# EAGLE design V2.0 (EAGLE 6.5.0)
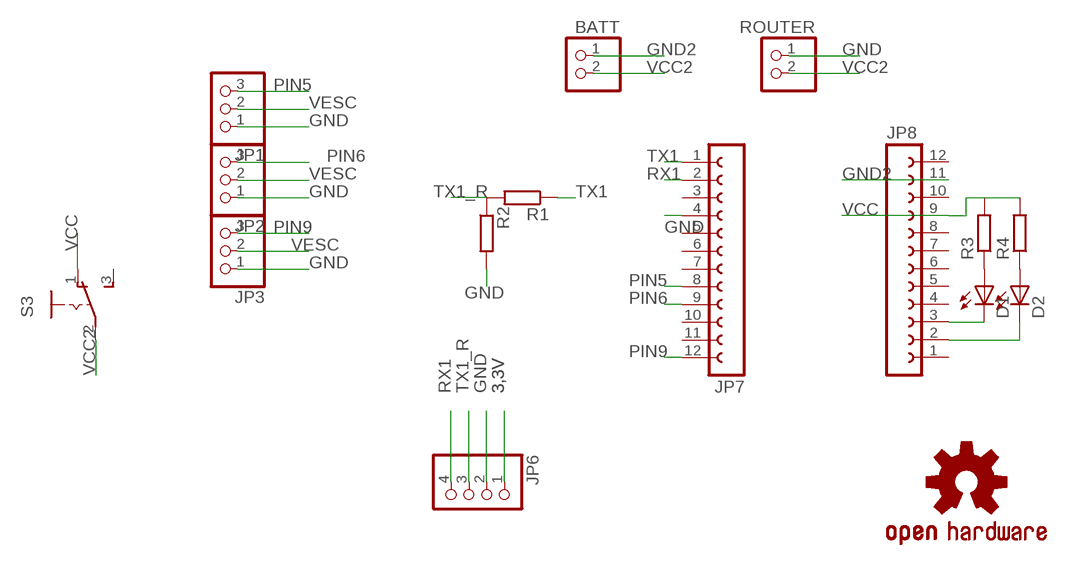
[diagram p0: schematic, sheet 1]

## Parts
BATT  PINHD-1X2/90  [1X02/90]
D1  LED3MM  [LED3MM]
D2  LED3MM  [LED3MM]
JP1  PINHD-1X3  [1X03]
JP2  PINHD-1X3  [1X03]
JP3  PINHD-1X3  [1X03]
JP6  PINHD-1X4  [1X04]
JP7  FE12-1  [FE12]
JP8  FE12-1  [FE12]
R1  R-EU_0204/7  [0204/7]
R2  R-EU_0204/7  [0204/7]
R3  R-EU_0204/7  [0204/7]
R4  R-EU_0204/7  [0204/7]
ROUTER  PINHD-1X2/90  [1X02/90]
S3  M251  [M251]
U$2  OSHW-LOGOS  [OSHW-LOGO-S]

## Nets
3,3V: JP6.1
GND: JP1.1 JP2.1 JP3.1 JP6.2 JP7.4 R2.2 ROUTER.1
GND2: BATT.1 JP8.11
N$2: D2.K(C) JP8.2
N$3: D1.K(C) JP8.3
N$6: D1.A R3.1
N$7: D2.A R4.1
PIN5: JP1.3 JP7.8
PIN6: JP2.3 JP7.9
PIN9: JP3.3 JP7.12
RX1: JP6.4 JP7.2
TX1: JP7.1 R1.1
TX1_R: JP6.3 R1.2 R2.1
VCC: JP8.9 R3.2 R4.2 S3.1(O)
VCC2: BATT.2 ROUTER.2 S3.2(P)
VESC: JP1.2 JP2.2 JP3.2
Unconnected: JP7.3 JP7.5 JP7.6 JP7.7 JP7.10 JP7.11 JP8.1 JP8.4 JP8.5 JP8.6 JP8.7 JP8.8 JP8.10 JP8.12 S3.3(S)

## Library data of the parts
BATT ROUTER = pinhead:PINHD-1X2: PIN HEADER
D1 D2 = led:LED: LED OSRAM: - CHIPLED LG R971, LG N971, LY N971, LG Q971, LY Q971, LO R971, LY R971 LH N974, LH R974 LS Q976, LO Q976, LY Q976 LO Q996 - Hyper CHIPLED LW Q18S LB Q993, LB Q99A, LB R99A - SideLED LS A670, LO A670, LY A670, LG A670, LP A670 LB A673, LV A673, LT A673, LW A673 LH A674 LY A675 LS A676, LA A676, LO A676, LY A676, LW A676 LS A679, LY A679, LG A679 - Hyper Micro SIDELED® LS Y876, LA Y876, LO Y876, LY Y876 LT Y87S - SmartLED LW L88C, LW L88S LB L89C, LB L89S, LG L890 LS L89K, LO L89K, LY L89K LS L896, LA L896, LO L896, LY L896 - TOPLED LS T670, LO T670, LY T670, LG T670, LP T670 LSG T670, LSP T670, LSY T670, LOP T670, LYG T670 LG T671, LOG T671, LSG T671 LB T673, LV T673, LT T673, LW T673 LH T674 LS T676, LA T676, LO T676, LY T676, LB T676, LH T676, LSB T676, LW T676 LB T67C, LV T67C, LT T67C, LS T67K, LO T67K, LY T67K, LW E67C LS E67B, LA E67B, LO E67B, LY E67B, LB E67C, LV E67C, LT E67C LW T67C LS T679, LY T679, LG T679 LS T770, LO T770, LY T770, LG T770, LP T770 LB T773, LV T773, LT T773, LW T773 LH T774 LS E675, LA E675, LY E675, LS T675 LS T776, LA T776, LO T776, LY T776, LB T776 LHGB T686 LT T68C, LB T68C - Hyper Mini TOPLED® LB M676 - Mini TOPLED Santana® LG M470 LS M47K, LO M47K, LY M47K Source: http://www.osram.convergy.de LUXEON: - LUMILED® LXK2-PW12-R00, LXK2-PW12-S00, LXK2-PW14-U00, LXK2-PW14-V00 LXK2-PM12-R00, LXK2-PM12-S00, LXK2-PM14-U00 LXK2-PE12-Q00, LXK2-PE12-R00, LXK2-PE12-S00, LXK2-PE14-T00, LXK2-PE14-U00 LXK2-PB12-K00, LXK2-PB12-L00, LXK2-PB12-M00, LXK2-PB14-N00, LXK2-PB14-P00, LXK2-PB14-Q00 LXK2-PR12-L00, LXK2-PR12-M00, LXK2-PR14-Q00, LXK2-PR14-R00 LXK2-PD12-Q00, LXK2-PD12-R00, LXK2-PD12-S00 LXK2-PH12-R00, LXK2-PH12-S00 LXK2-PL12-P00, LXK2-PL12-Q00, LXK2-PL12-R00 Source: www.luxeon.com KINGBRIGHT: KA-3528ASYC Source: www.kingbright.com
JP1-JP3 = pinhead:PINHD-1X3: PIN HEADER
JP6 = pinhead:PINHD-1X4: PIN HEADER
JP7 JP8 = con-lsta:FE12-1: FEMALE HEADER; OC_FARNELL: unknown; OC_NEWARK: unknown
R1-R4 = rcl:R-EU_: RESISTOR, European symbol
S3 = switch:M251: SLIDING SWITCH Mors, distributor Buerklin, 11G702
U$2 = SparkFun:OSHW-LOGO: Open Source Hardware Logo This logo indicates the piece of hardware it is found on incorporates a OSHW license and/or adheres to the definition of open source hardware found here: http://freedomdefined.org/OSHW

## Board
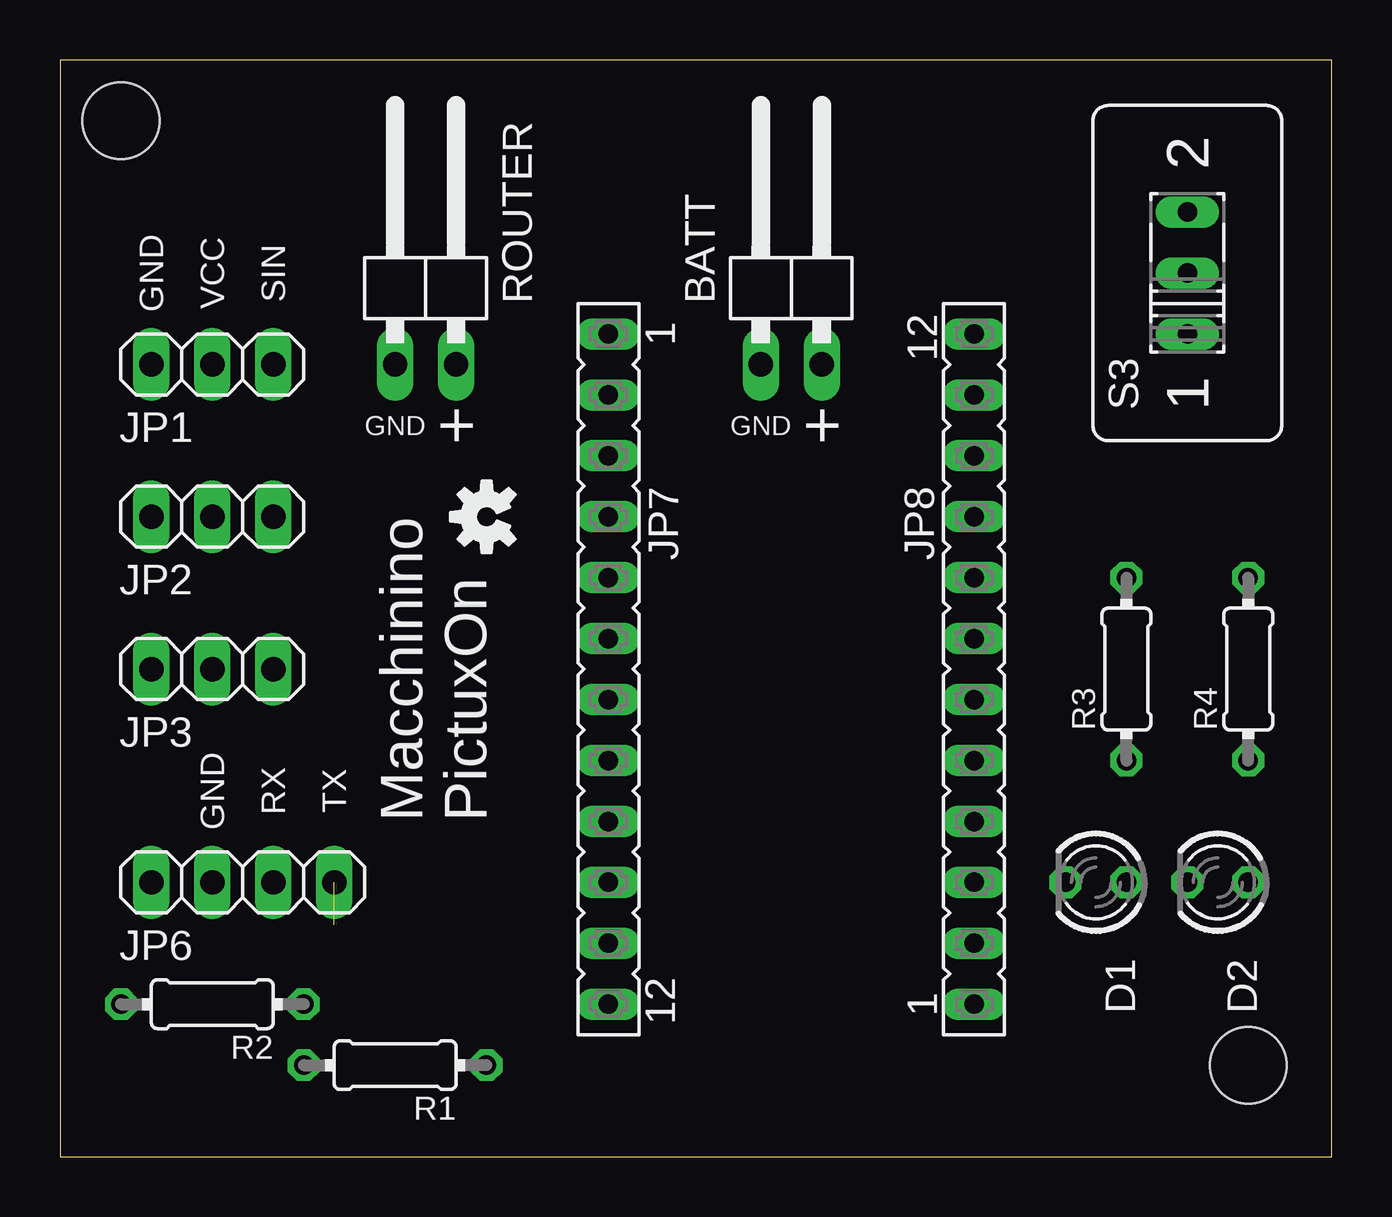
[diagram p1: board, top side]
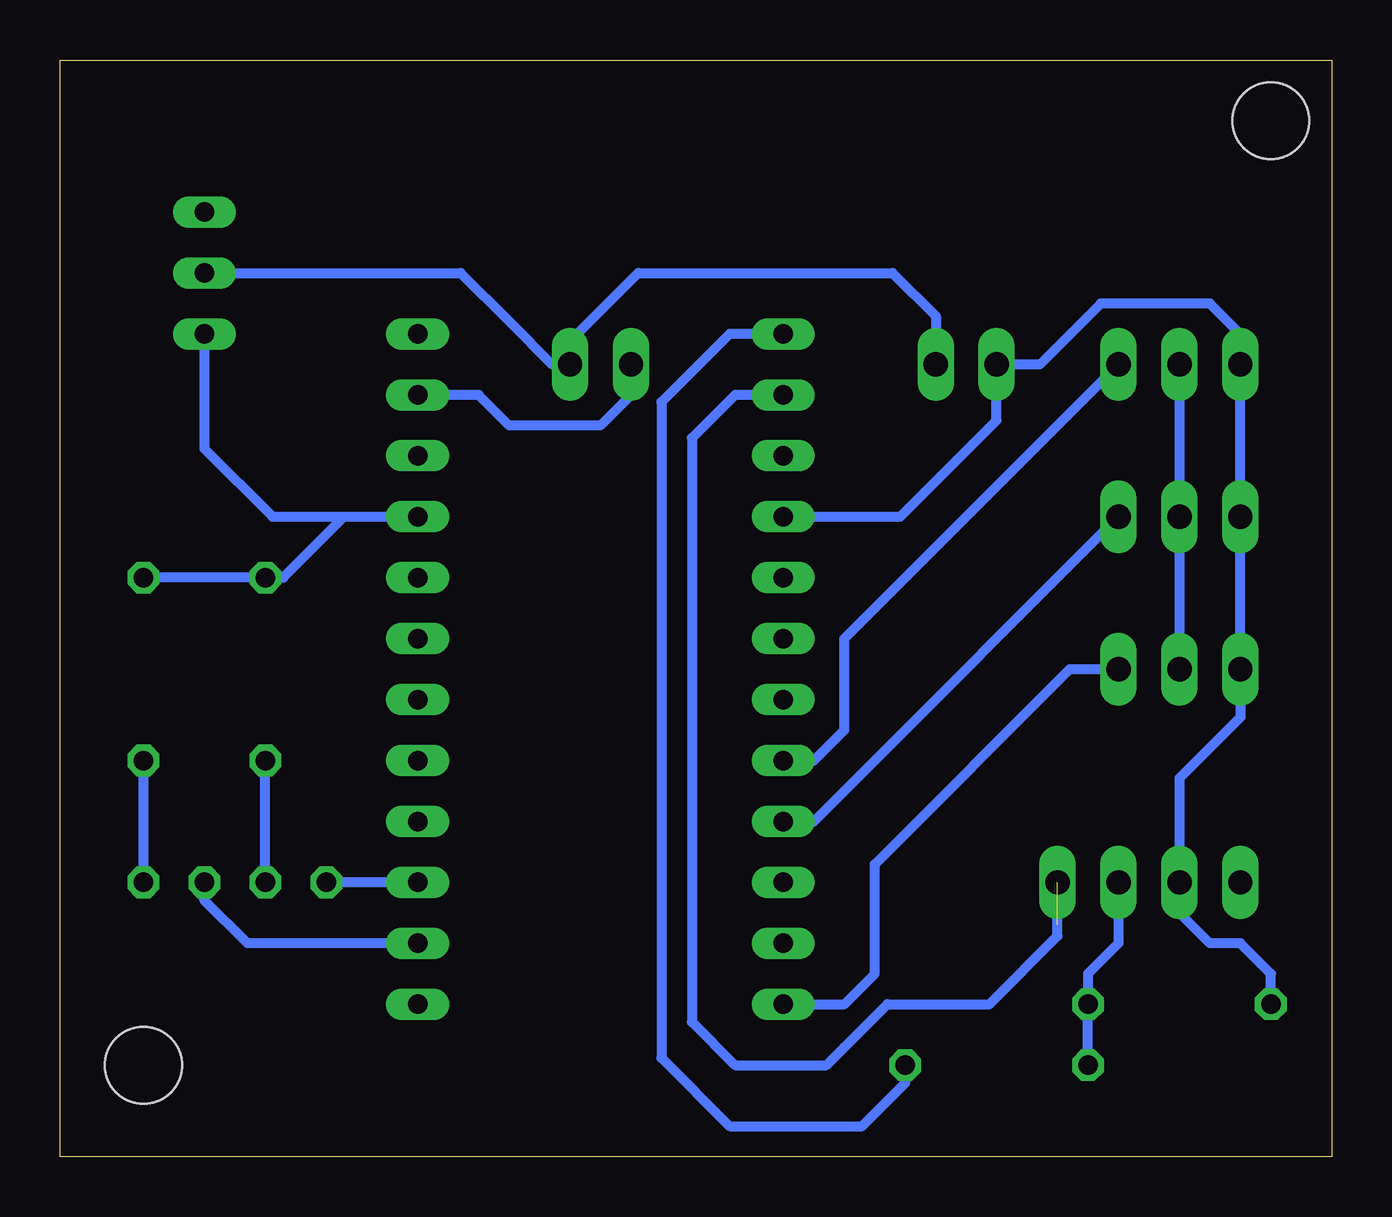
[diagram p2: board, bottom side, seen from below]

Size 53.01 x 45.71 mm. Coordinates in mm from the lower left corner, seen from the top.
Outline: 0,0 53.01,0 53.01,45.71 0,45.71 0,0
Copper layers (1*16): Top 0.035mm / dielectric 1.5mm / Bottom 0.035mm
Design rules "default": minimum track width 10mil, minimum drill 24mil, track to track 8mil, track to pad 8mil, pad to pad 8mil, via to via 8mil, smd to smd 8mil, copper to edge 40mil, drill to drill 8mil, minimum pad ring 10mil, minimum via ring 8mil, stop-mask expansion 4mil, vias tented up to drill 0mil, thermal gap 10mil
Holes 3.2 mm at 49.53,3.81 2.54,43.18

### Footprints (pad centres in the part's own frame; a part is rotated, then mirrored left to right if it is on the bottom)
1X02/90 = drill 1.016 long: 1 -1.27,-3.81; 2 1.27,-3.81
LED3MM = drill 0.813 octagon: A -1.27,0; K 1.27,0
1X03 = drill 1.016 long: 1 -2.54,0; 2 0,0; 3 2.54,0
1X04 = drill 1.016 long: 1 -3.81,0; 2 -1.27,0; 3 1.27,0; 4 3.81,0
FE12 = drill 0.813 long: 1 -13.97,0; 2 -11.43,0; 3 -8.89,0; 4 -6.35,0; 5 -3.81,0; 6 -1.27,0; 7 1.27,0; 8 3.81,0; 9 6.35,0; 10 8.89,0; 11 11.43,0; 12 13.97,0
0204/7 = drill 0.813 octagon: 1 -3.81,0; 2 3.81,0
M251 = drill 0.813 long: 1 -2.54,0; 2 0,0; 3 2.54,0

### Placement (x,y rotation side)
BATT  30.48,36.83 0 top
D1  43.18,11.43 180 top
D2  48.26,11.43 180 top
JP1  6.35,33.02 0 top
JP2  6.35,26.67 0 top
JP3  6.35,20.32 0 top
JP6  7.62,11.43 0 top
JP7  22.86,20.32 270 top
JP8  38.1,20.32 90 top
R1  13.97,3.81 180 top
R2  6.35,6.35 180 top
R3  44.45,20.32 90 top
R4  49.53,20.32 90 top
ROUTER  15.24,36.83 0 top
S3  46.99,36.83 90 top
U$2  17.78,26.67 90 top

### Tracks (layer width: path | path; a pad name or v marks a point on that pad's centre or on a via)
GND
  Bottom 0.406: R2.2 2.54,7.62 3.81,8.89 5.08,8.89 6.35,10.16 JP6.2 6.35,15.77 3.81,18.31 JP3.1 JP2.1 JP1.1 3.81,34.29 5.08,35.56 9.63,35.56 12.17,33.02 ROUTER.1 13.97,30.69 17.99,26.67 JP7.4
GND2
  Bottom 0.406: BATT.1 29.21,31.75 30.48,30.48 34.29,30.48 35.56,31.75 JP8.11
N$2
  Bottom 0.406: JP8.2 45.19,8.89 46.99,10.69 D2.K
N$3
  Bottom 0.406: JP8.3 D1.K
N$6
  Bottom 0.406: D1.A R3.1
N$7
  Bottom 0.406: D2.A R4.1
PIN5
  Bottom 0.406: JP7.8 21.59,16.51 20.32,17.78 20.32,21.59 JP1.3
PIN6
  Bottom 0.406: JP7.9 21.59,13.97 20.32,15.24 JP2.3
PIN9
  Bottom 0.406: JP7.12 20.32,6.35 19.05,7.62 19.05,12.19 10.92,20.32 JP3.3
RX1  (1 unrouted)
  Bottom 0.406: JP7.2 24.87,31.75 26.67,29.95 26.67,5.61 24.87,3.81 21.06,3.81 20.32,4.55 18.52,6.35 14.27,6.35 11.43,9.19 JP6.4
TX1
  Bottom 0.406: JP7.1 25.1,34.29 27.94,31.45 27.94,4.11 25.1,1.27 19.58,1.27 17.78,3.07 R1.1
TX1_R
  Bottom 0.406: R1.2 R2.1 10.16,7.62 8.89,8.89 JP6.3
VCC
  Bottom 0.406: R4.2 R3.2 43.71,24.13 41.17,26.67 JP8.9 44.15,26.67 46.99,29.51 S3.1
VCC2
  Bottom 0.406: ROUTER.2 16.51,35.03 18.31,36.83 28.91,36.83 31.75,33.99 BATT.2 32.49,33.02 34.29,34.82 36.3,36.83 S3.2
VESC
  Bottom 0.406: JP1.2 JP2.2 JP3.2

### Text on the board
tNames: GND | VCC | SIN | GND | + | GND | + | GND | RX | TX | Macchinino / PictuxOn